# Altium schematic sheet LPGDetA1_cpu.SchDoc
size A4; DocumentNumber: 3; SheetNumber: 3; SheetTotal: 6; Subtitle0: Mikrokontoler; LotOfPieces: 1; SVNPath: SVNPath
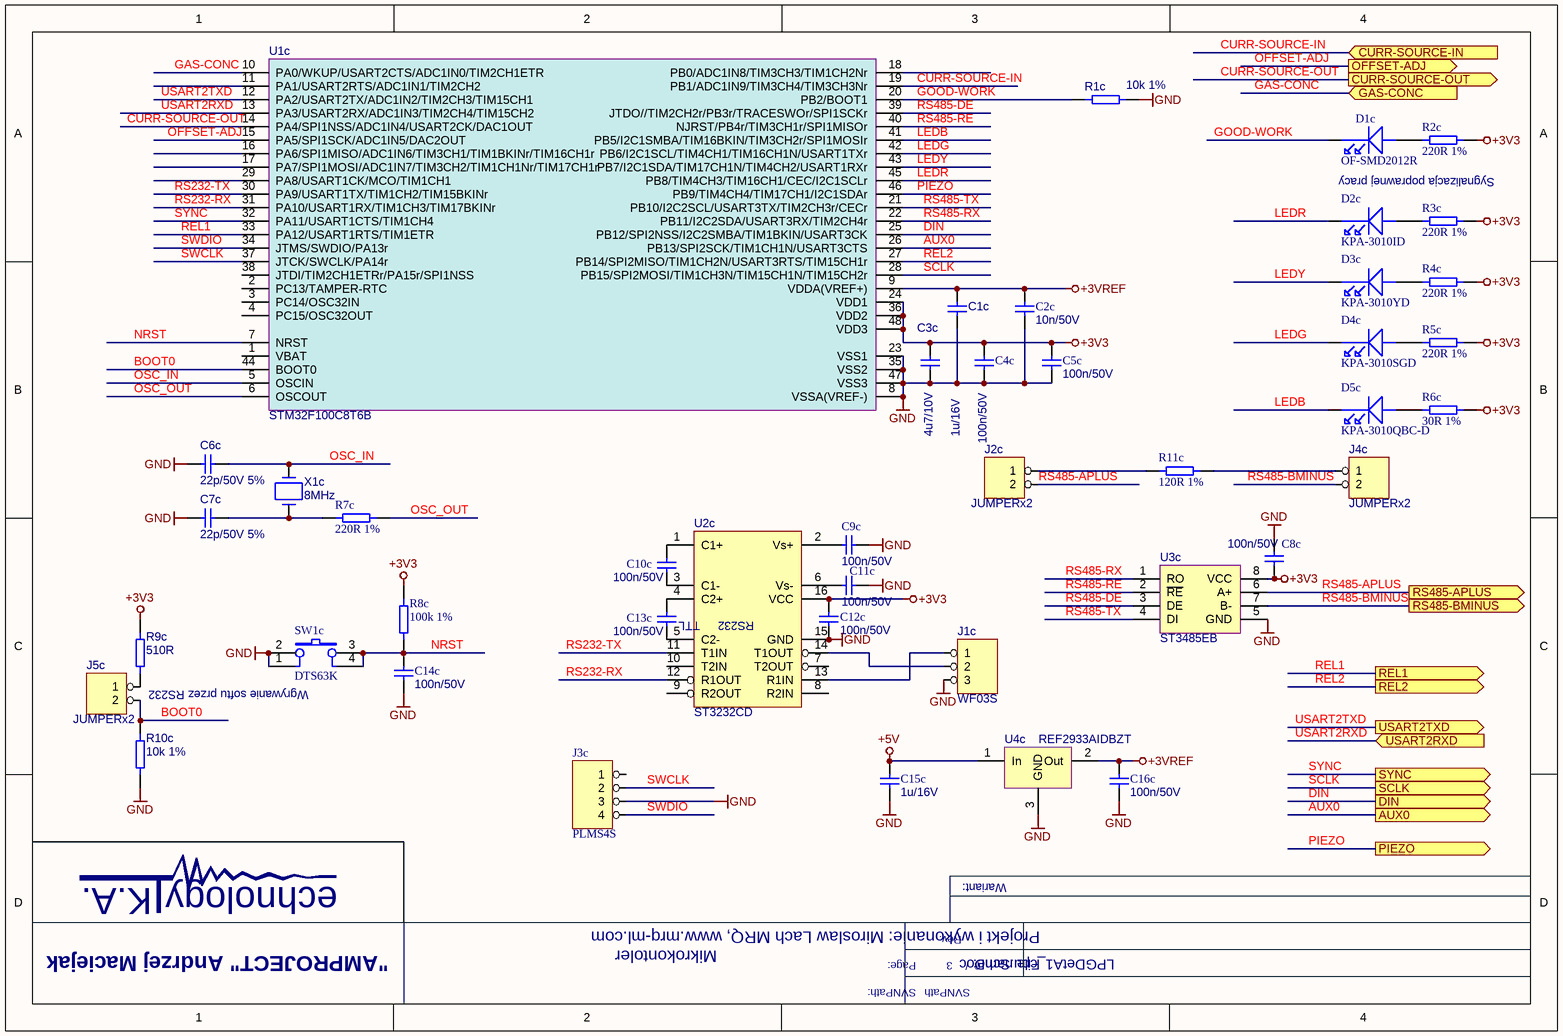
[diagram p0: LPGDetA1_cpu.SchDoc]

## Parts
?  (no value)
C1c  OtherParams: 1u/16V  [1206_0805]  (hidden comment: C0805C105K4RAC)
C2c  OtherParams: 10n/50V  [1206_0805]  (hidden comment: CL21B103KBANNNC)
C3c  OtherParams: 4u7/10V  [1206-IPC]  (hidden comment: CL31B475KPHNNNE)
C4c  OtherParams: 100n/50V  [1206_0805]  (hidden comment: CL21B104KBCNNNC)
C5c  OtherParams: 100n/50V  [1206_0805]  (hidden comment: CL21B104KBCNNNC)
C6c  OtherParams: 22p/50V 5%  [0805]  (hidden comment: CL21C220JBANNNC)
C7c  OtherParams: 22p/50V 5%  [0805]  (hidden comment: CL21C220JBANNNC)
C8c  OtherParams: 100n/50V  [1206_0805]  (hidden comment: CL21B104KBCNNNC)
C9c  OtherParams: 100n/50V  [1206_0805]  (hidden comment: CL21B104KBCNNNC)
C10c  OtherParams: 100n/50V  [1206_0805]  (hidden comment: CL21B104KBCNNNC)
C11c  OtherParams: 100n/50V  [1206_0805]  (hidden comment: CL21B104KBCNNNC)
C12c  OtherParams: 100n/50V  [1206_0805]  (hidden comment: CL21B104KBCNNNC)
C13c  OtherParams: 100n/50V  [1206_0805]  (hidden comment: CL21B104KBCNNNC)
C14c  OtherParams: 100n/50V  [1206_0805]  (hidden comment: CL21B104KBCNNNC)
C15c  OtherParams: 1u/16V  [1206_0805]  (hidden comment: C0805C105K4RAC)
C16c  OtherParams: 100n/50V  [1206_0805]  (hidden comment: CL21B104KBCNNNC)
D1c  OF-SMD2012R  [D0805]
D2c  KPA-3010ID  [KPA-3010SURCK]
D3c  KPA-3010YD  [KPA-3010SYCK]
D4c  KPA-3010SGD  [KPA-3010CGCK]
D5c  KPA-3010QBC-D  [KPA-3010QBC-D]
J1c  WF03S  [WF03S]
J2c  JUMPERx2  [2SIP100]
J3c  PLMS4S  [PLMS4S]
J4c  JUMPERx2  [2SIP100]
J5c  JUMPERx2  [2SIP100]
R1c  OtherParams: 10k 1%  [0805]  (hidden comment: 0805WAF10KT5E)
R2c  OtherParams: 220R 1%  [0805]  (hidden comment: 0805WAF 220R T5E)
R3c  OtherParams: 220R 1%  [0805]  (hidden comment: 0805WAF 220R T5E)
R4c  OtherParams: 220R 1%  [0805]  (hidden comment: 0805WAF 220R T5E)
R5c  OtherParams: 220R 1%  [0805]  (hidden comment: 0805WAF 220R T5E)
R6c  OtherParams: 30R 1%  [0805]  (hidden comment: 0805WAF 30R T5E)
R7c  OtherParams: 220R 1%  [0805]  (hidden comment: 0805WAF 220R T5E)
R8c  OtherParams: 100k 1%  [0805]  (hidden comment: 0805WAF 100K T5E)
R9c  OtherParams: 510R  [0805]  (hidden comment: 0805WAJ 510R T5E)
R10c  OtherParams: 10k 1%  [0805]  (hidden comment: 0805WAF10KT5E)
R11c  OtherParams: 120R 1%  [1206_0805]  (hidden comment: 0805WAF 120R T5E)
SW1c  DTS63K  [DTS63K]
U1c  STM32F100C8T6B  [MS-026ABC]
U2c  ST3232CD  [16SOIC150]
U3c  ST3485EB  [8SOIC150]
U4c  REF2933AIDBZT  [SOT23-3]
X1c  8MHz  [HXC-7SB]

## Ports
AUX0, CURR-SOURCE-IN, CURR-SOURCE-OUT, DIN, GAS-CONC, OFFSET-ADJ, PIEZO, REL1, REL2, RS485-APLUS, RS485-BMINUS, SCLK, SYNC, USART2RXD, USART2TXD

## Nets
+3V3: C3c.1 C4c.1 C5c.1 C8c.2 C12c.1 R2c.2 R3c.2 R4c.2 R5c.2 R6c.2 R8c.1 R9c.1 U1c.24(VDD1) U1c.36(VDD2) U1c.48(VDD3) U2c.16(VCC) U3c.8(VCC)
+3VREF: C1c.1 C2c.1 C16c.1 U1c.9(VDDA(VREF+)) U4c.2(Out)
+5V: C15c.1 U4c.1(In)
GND: C1c.2 C2c.2 C3c.2 C4c.2 C5c.2 C6c.1 C7c.1 C8c.1 C9c.2 C11c.2 C12c.2 C14c.2 C15c.2 C16c.2 J1c.3 J3c.3 R1c.2 R10c.1 SW1c.1 SW1c.2 U1c.8(VSSA(VREF-)) U1c.23(VSS1) U1c.35(VSS2) U1c.47(VSS3) U2c.15(GND) U3c.5(GND) U4c.3(GND)
AUX0: U1c.26(PB13/SPI2SCK/TIM1CH1N/USART3CTS) ; port AUX0
BOOT0: J5c.2 R10c.2 U1c.44(BOOT0)
CURR-SOURCE-IN: U1c.19(PB1/ADC1IN9/TIM3CH4/TIM3CH3Nr) ; port CURR-SOURCE-IN
CURR-SOURCE-OUT: U1c.14(PA4/SPI1NSS/ADC1IN4/USART2CK/DAC1OUT) ; port CURR-SOURCE-OUT
DIN: U1c.25(PB12/SPI2NSS/I2C2SMBA/TIM1BKIN/USART3CK) ; port DIN
GAS-CONC: U1c.10(PA0/WKUP/USART2CTS/ADC1IN0/TIM2CH1ETR) ; port GAS-CONC
GOOD-WORK: D1c.CATH R1c.1 U1c.20(PB2/BOOT1)
LEDB: D5c.CATH U1c.41(PB5/I2C1SMBA/TIM16BKIN/TIM3CH2r/SPI1MOSIr)
LEDG: D4c.CATH U1c.42(PB6/I2C1SCL/TIM4CH1/TIM16CH1N/USART1TXr)
LEDR: D2c.CATH U1c.45(PB8/TIM4CH3/TIM16CH1/CEC/I2C1SCLr)
LEDY: D3c.CATH U1c.43(PB7/I2C1SDA/TIM17CH1N/TIM4CH2/USART1RXr)
NRST: C14c.1 R8c.2 SW1c.3 SW1c.4 U1c.7(NRST)
OFFSET-ADJ: U1c.15(PA5/SPI1SCK/ADC1IN5/DAC2OUT) ; port OFFSET-ADJ
OSC_IN: C6c.2 U1c.5(OSCIN) X1c.1
OSC_OUT: R7c.2 U1c.6(OSCOUT)
PIEZO: U1c.46(PB9/TIM4CH4/TIM17CH1/I2C1SDAr) ; port PIEZO
REL1: U1c.33(PA12/USART1RTS/TIM1ETR) ; port REL1
REL2: U1c.27(PB14/SPI2MISO/TIM1CH2N/USART3RTS/TIM15CH1r) ; port REL2
RS232-RX: U1c.31(PA10/USART1RX/TIM1CH3/TIM17BKINr) U2c.12(R1OUT)
RS232-TX: U1c.30(PA9/USART1TX/TIM1CH2/TIM15BKINr) U2c.11(T1IN)
RS485-APLUS: J2c.2 U3c.6(A+) ; port RS485-APLUS
RS485-BMINUS: J4c.2 U3c.7(B-) ; port RS485-BMINUS
RS485-DE: U1c.39(JTDO//TIM2CH2r/PB3r/TRACESWOr/SPI1SCKr) U3c.3(DE)
RS485-RE: U1c.40(NJRST/PB4r/TIM3CH1r/SPI1MISOr) U3c.2(~{RE})
RS485-RX: U1c.22(PB11/I2C2SDA/USART3RX/TIM2CH4r) U3c.1(RO)
RS485-TX: U1c.21(PB10/I2C2SCL/USART3TX/TIM2CH3r/CECr) U3c.4(DI)
SCLK: U1c.28(PB15/SPI2MOSI/TIM1CH3N/TIM15CH1N/TIM15CH2r) ; port SCLK
SWCLK: J3c.2 U1c.37(JTCK/SWCLK/PA14r)
SWDIO: J3c.4 U1c.34(JTMS/SWDIO/PA13r)
SYNC: U1c.32(PA11/USART1CTS/TIM1CH4) ; port SYNC
USART2RXD: U1c.13(PA3/USART2RX/ADC1IN3/TIM2CH4/TIM15CH2) ; port USART2RXD
USART2TXD: U1c.12(PA2/USART2TX/ADC1IN2/TIM2CH3/TIM15CH1) ; port USART2TXD
NetC7c_2: C7c.2 R7c.1 X1c.2
NetC9c_1: C9c.1 U2c.2(Vs+)
NetC10c_1: C10c.1 U2c.1(C1+)
NetC10c_2: C10c.2 U2c.3(C1-)
NetC11c_1: C11c.1 U2c.6(Vs-)
NetC13c_1: C13c.1 U2c.4(C2+)
NetC13c_2: C13c.2 U2c.5(C2-)
NetD1c_ANOD: D1c.ANOD R2c.1
NetD2c_ANOD: D2c.ANOD R3c.1
NetD3c_ANOD: D3c.ANOD R4c.1
NetD4c_ANOD: D4c.ANOD R5c.1
NetD5c_ANOD: D5c.ANOD R6c.1
NetJ1c_1: J1c.1 U2c.13(R1IN)
NetJ1c_2: J1c.2 U2c.14(T1OUT)
NetJ2c_1: J2c.1 R11c.1
NetJ4c_1: J4c.1 R11c.2
NetJ5c_1: J5c.1 R9c.2

Not connected (* = marked no-connect by the designer): J3c 1; U1c 1(VBAT) 2(PC13/TAMPER-RTC) 3(PC14/OSC32IN) 4(PC15/OSC32OUT) 11(PA1/USART2RTS/ADC1IN1/TIM2CH2) 16(PA6/SPI1MISO/ADC1IN6/TIM3CH1/TIM1BKINr/TIM16CH1r) 17(PA7/SPI1MOSI/ADC1IN7/TIM3CH2/TIM1CH1Nr/TIM17CH1r) 18(PB0/ADC1IN8/TIM3CH3/TIM1CH2Nr) 29(PA8/USART1CK/MCO/TIM1CH1) 38(JTDI/TIM2CH1ETRr/PA15r/SPI1NSS); U2c 7(T2OUT) 8(R2IN) 9(R2OUT) 10(T2IN)

## Notes on the sheet
- Sygnalizacja poprawnej pracy
- Wgrywanie softu przez RS232
- K.A.
- echnology
- Wariant:
- Projekt i wykonanie: Miroslaw Lach MRQ, www.mrq-ml.com
- "AMPROJECT" Andrzej Maciejak
- SVNPath:
- Page:
- Rev.
- /
- File name:
- (in symbol ST3232CD[[/\]]16SOIC150) TTL; RS232

## Library data of the parts
? = KATECHNOLOGYLOGO
C1c = C0805C105K4RAC[[/\]]0805[[/\]]16V[[/\]]10%[[/\]]1u/16V: Manufacturer1: KEMET; MaxVoltage: 16V; Tolerance: 10%; Tmin: -55; Tmax: +125; Descript: capacitor 1uF, 16V, 0805, 10%, X7R; Currency1: PLZ; Amount1: 10000+; Currency5: PLN; Amount5: 100+; Value: C0805C105K4RAC; Supplier1: tme.pl; Reference1: C0805C105K4RAC; Price1: 0,099; Typ1: C0805C105K4RAC; Dimensions: 0805; ComponentLink1Description: Datasheet; ComponentLink1URL: http://www.mrq-ml.com/Parts/Capacitors/ceramic_chip_kemet.pdf; DateOfPrice1: 2010-03-06; Supplier5: tme.pl; Reference5: C0805C105K4RAC; Manufacturer5: KEMET; Typ5: C0805C105K4RAC; Price5: 0,099; DateOfPrice5: 2013-01-03
C2c = CL21B103KBANNNC[[/\]]0805[[/\]]50V[[/\]]10%[[/\]]10n/50V: MaxVoltage: 50V; Tolerance: 10%; Descript: capacitor 10nF/50V, 0805, X7R, 10%; Currency5: PLN; Amount5: 100+; Value: CL21B103KBANNNC; Dimensions: 0805; ComponentLink1Description: Datasheet; ComponentLink1URL: http://www.mrq-ml.com/Parts/Capacitors/mlcc_samsung.pdf; Supplier5: tme.pl; Reference5: CL21B103KBANNNC; Manufacturer5: Samsung; Typ5: CL21B103KBANNNC; Price5: 0,029; DateOfPrice5: 2012-09-19; Price1: 0,013
C3c = CL31B475KPHNNNE[[/\]]1206[[/\]]10V[[/\]]10%[[/\]]4u7/10V: Manufacturer1: Samsung; MaxVoltage: 10V; Tolerance: 10%; Tmin: -55; Tmax: +125; Descript: capacitor 4.7uF, 10V, X7R, 10%, 1206; Currency1: PLN; Amount1: 12000+; Amount5: 100+; Value: CL31B475KPHNNNE; Supplier1: tme.pl; Reference1: CL31B475KPHNNNE; Typ1: CL31B475KPHNNNE; Dimensions: 1206; ComponentLink1Description: Datasheet; ComponentLink1URL: http://www.mrq-ml.com/Parts/Capacitors/mlcc_samsung.pdf; DateOfPrice1: 2010-09-07; Supplier5: tme.pl; Reference5: CL31B475KPHNNNE; Manufacturer5: Samsung; Typ5: CL31B475KPHNNNE; Price5: 0,179; Currency5: PLN; DateOfPrice5: 2012-11-24; Price1: 0,179
C4c C5c C8c C9c C10c C11c C12c C13c C14c C16c = CL21B104KBCNNNC[[/\]]0805[[/\]]50V[[/\]]10%[[/\]]100n/50V: MaxVoltage: 50V; Tolerance: 10%; Descript: capacitor 100nF/50V, 0805, X7R, 10%; Currency5: PLN; Amount5: 100+; Value: CL21B104KBCNNNC; Price1: 0,019; Dimensions: 0805; ComponentLink1Description: Datasheet; ComponentLink1URL: http://www.mrq-ml.com/Parts/Capacitors/mlcc_samsung.pdf; Supplier5: tme.pl; Reference5: CL21B104KBCNNNC; Manufacturer5: Samsung; Typ5: CL21B104KBCNNNC; Price5: 0,025; DateOfPrice5: 2013-01-03
C6c C7c = CL21C220JBANNNC[[/\]]0805[[/\]]50V[[/\]]5%[[/\]]22p/50V 5%: Manufacturer1: Samsung; Amount2: 4000+; MaxVoltage: 50V; Tolerance: 5%; Tmin: -55; Tmax: +125; Descript: capacitor 22pF, 50V, COG 5%; Currency1: PLZ; Amount1: 12000+; Currency5: PLN; Amount5: 100+; Value: CL21C220JBANNNC; Supplier1: tme.pl; Reference1: CL21C220JBANNNC; Price1: 0,018; Price2: 0,012; Reference2: CL21C220JBANNNC; Supplier2: tme.pl; Typ1: CL21C220JBANNNC; Manufacturer2: Samsung; Dimensions: 0805; ComponentLink1Description: Datasheet; ComponentLink1URL: http://www.mrq-ml.com/Parts/Capacitors/mlcc_samsung.pdf; DateOfPrice1: 2010-04-07; Typ2: CL21C220JBANNNC; Currency2: PLZ; DateOfPrice2: 2009-08-16; Supplier5: tme.pl; Reference5: CL21C220JBANNNC; Manufacturer5: Samsung; Typ5: CL21C220JBANNNC; Price5: 0,029; DateOfPrice5: 2012-09-19
C15c = C0805C105K4RAC[[/\]]0805[[/\]]16V[[/\]]10%[[/\]]1u/16V: MaxVoltage: 16V; Tolerance: 10%; Descript: capacitor 1uF, 16V, 0805, 10%, X7R; Currency5: PLN; Amount5: 100+; Value: C0805C105K4RAC; Dimensions: 0805; ComponentLink1Description: Datasheet; ComponentLink1URL: http://www.mrq-ml.com/Parts/Capacitors/ceramic_chip_kemet.pdf; Supplier5: tme.pl; Reference5: C0805C105K4RAC; Manufacturer5: KEMET; Typ5: C0805C105K4RAC; Price5: 0,099; DateOfPrice5: 2013-01-03; Price1: 0,099
D1c = OF-SMD2012R[[/\]]D0805: Descript: LED; SMD; 0805; czerwony; 90-120mcd; 120°; Currency5: PLZ; Amount5: 10+; Value: OF-SMD2012R; Dimensions: D0805; ComponentLink1Description: Datasheet; ComponentLink1URL: http://www.mrq-ml.com/Parts/Diodes/of-smd2012r.pdf; Supplier5: tme.pl; Reference5: OF-SMD2012R; Manufacturer5: Optoflash; Typ5: OF-SMD2012R; Price5: 0,21; DateOfPrice5: 2012-11-24; Price1: 0,14
D2c = KPA-3010ID[[/\]]KPA-3010ID: Descript: 3.0x1.0mm Right angle smd chip led lamp red; Currency5: PLN; Amount5: 10+; Value: KPA-3010ID; Dimensions: KPA-3010ID; ComponentLink1Description: Datasheet; ComponentLink1URL: http://www.mrq-ml.com/Parts/Diodes/kp-3010id.pdf; Supplier5: tme.pl; Reference5: KPA-3010ID; Manufacturer5: Kingbright Electronic; Typ5: KPA-3010ID; Price5: 0,339; DateOfPrice5: 2013-01-12; Price1: 0,287
D3c = KPA-3010YD[[/\]]KPA-3010YD: Descript: 3.0x1.0mm Right angle smd chip led lamp yellow; Currency5: PLN; Amount5: 10+; Value: KPA-3010YD; Dimensions: KPA-3010YD; ComponentLink1Description: Datasheet; ComponentLink1URL: http://www.mrq-ml.com/Parts/Diodes/kpa-3010.pdf; Supplier5: tme.pl; Reference5: KPA-3010YD; Manufacturer5: Kingbright Electronic; Typ5: KPA-3010YD; Price5: 0,383; DateOfPrice5: 2013-01-12; Price1: 0,326
D4c = KPA-3010SGD[[/\]]KPA-3010SGD: Descript: 3.0x1.0mm Right angle smd chip led lamp green; Currency5: PLN; Amount5: 10+; Value: KPA-3010SGD; Dimensions: KPA-3010SGD; ComponentLink1Description: Datasheet; ComponentLink1URL: http://www.mrq-ml.com/Parts/Diodes/kpa-3010.pdf; Supplier5: tme.pl; Reference5: KPA-3010SGD; Manufacturer5: Kingbright Electronic; Typ5: KPA-3010SGD; Price5: 0,354; DateOfPrice5: 2013-01-12; Price1: 0,275
D5c = KPA-3010QBC-D[[/\]]KPA-3010QBC-D: Descript: 3.0x1.0mm Right angle smd chip led lamp blue; Reference5: 2146443; Currency5: PLN; Amount5: 1+; Value: KPA-3010QBC-D; Dimensions: KPA-3010QBC-D; ComponentLink1Description: Datasheet; ComponentLink1URL: http://www.mrq-ml.com/Parts/Diodes/KPA-3010QBC-D.pdf; Supplier5: farnell.com; Manufacturer5: Kingbright Electronic; Typ5: KPA-3010QBC-D; Price5: 0,87; DateOfPrice5: 2012-12-10; Price1: 0,7
J1c = WF03S[[/\]]WF03S: Descript: connector 2,54mm pitch, THT, 3 pole, stright; Reference1: WF03S-LF; Currency1: PLN; Amount1: 5000+; Reference5: WF03S-JS; Amount5: 10+; Value: WF03S; Dimensions: WF03S; ComponentLink1Description: Datasheet; ComponentLink1URL: http://www.mrq-ml.com/Parts/Connectors/WFXXS.pdf; Supplier1: maritex.com.pl; DateOfPrice1: 2010-03-06; Supplier5: maritex.com.pl; Price5: 0,055; Currency5: PLN; DateOfPrice5: 2012-11-24; Price1: 0,0550
J2c J4c J5c = JUMPERx2[[/\]]2.54mm: Descript: pin header 2 pin, 1/40 of PLD80S; Reference1: PLD80S-2; Currency1: PLN; Amount1: 80000+; Currency2: PLZ; Amount2: 40000+; Amount3: 9600+; Amount4: 1600+; Amount5: 20+; Value: JUMPERx2; Dimensions: 2.54mm; Supplier1: maritex.com.pl; DateOfPrice1: 2010-03-13; Supplier2: maritex.com.pl; Reference2: PLD80S-2; Price2: 0,01425; DateOfPrice2: 2009-11-24; Supplier3: maritex.com.pl; Reference3: PLD80S-2; Price3: 0,015; Currency3: PLZ; DateOfPrice3: 2009-11-24; Supplier4: maritex.com.pl; Reference4: PLD80S-2; Price4: 0,01575; Currency4: PLZ; DateOfPrice4: 2009-11-24; Supplier5: maritex.com.pl; Reference5: PLD80S-2; Price5: 0,0645; Currency5: PLN; DateOfPrice5: 2012-11-24; Price1: 0,0645
J3c = PLMS4S[[/\]]4x2mm: Descript: connector 2.00mm pitch, 4 poles, one row; Reference1: PLMS40S-LF*4/40; Currency1: PLN; Amount1: 500+; Reference5: PLMS40S-LF; Amount5: 1+; Value: PLMS4S; Dimensions: 4x2mm; ComponentLink1Description: Datasheet; ComponentLink1URL: http://www.mrq-ml.com/Parts/Connectors/plms40s-lf.pdf; Supplier1: maritex.com.pl; DateOfPrice1: 2010-11-19; Supplier5: maritex.com.pl; Price5: 0,085; Currency5: PLN; DateOfPrice5: 2012-11-24; Price1: 0,0850
R1c R10c = 0805WAF10KT5E[[/\]]0805[[/\]]0.125W[[/\]]1%[[/\]]10k 1%: Manufacturer1: Royal Ohm; Reference1: SMD0805 10K 1%; Amount1: 50000+; Amount2: 15000+; DissPower: 0.125W; Tolerance: 1%; Tmin: -55; Tmax: +155; Descript: Resistor 10kohm, 0805, 1%; Currency1: PLN; Currency2: PLZ; Amount4: 1000+; Reference5: SMD0805-10K-1%; Amount5: 100+; Value: 0805WAF10KT5E; Price2: 0,007; Reference2: SMD0805 10K 1%; Supplier1: tme.pl; Supplier2: tme.pl; Typ1: 0805WAF 10K T5E; Manufacturer2: Royal Ohm; Typ2: 0805WAF 10K T5E; Dimensions: 0805; ComponentLink1Description: Datasheet; ComponentLink1URL: http://www.mrq-ml.com/Parts/Resistors/RoyalOhm_rezystor-smd.pdf; DateOfPrice1: 2010-02-01; DateOfPrice2: 2009-10-20; Supplier4: tme.pl; Reference4: SMD0805 10K 1%; Manufacturer4: Royal Ohm; Typ4: 0805WAF 10K T5E; Price4: 0,019; Currency4: PLZ; DateOfPrice4: 2009-10-20; Supplier5: tme.pl; Manufacturer5: Royal Ohm; Typ5: 0805WAF 10K T5E; Price5: 0,029; Currency5: PLN; DateOfPrice5: 2013-01-03; Price1: 0,018
R2c R3c R4c R5c R7c = 0805WAF 220R T5E[[/\]]0805[[/\]]0.125W[[/\]]1%[[/\]]220R 1%: Manufacturer1: Royal Ohm; Reference1: SMD0805-220R-1%; Amount1: 50000+; DissPower: 0.125W; Tolerance: 1%; Descript: Resistor 220ohm, 0805, 1%; Currency1: PLN; Amount5: 100+; Value: 0805WAF 220R T5E; Supplier1: tme.pl; Typ1: 0805WAF 220R T5E; Dimensions: 0805; ComponentLink1Description: Datasheet; ComponentLink1URL: http://www.mrq-ml.com/Parts/Resistors/RoyalOhm_rezystor-smd.pdf; DateOfPrice1: 2012-01-30; Supplier5: tme.pl; Reference5: SMD0805-220R-1%; Manufacturer5: Royal Ohm; Typ5: 0805WAF 220R T5E; Price5: 0,029; Currency5: PLN; DateOfPrice5: 2012-09-19; Price1: 0,018
R6c = 0805WAF 30R T5E[[/\]]0805[[/\]]0.125W[[/\]]1%[[/\]]30R 1%: DissPower: 0.125W; Tolerance: 1%; Descript: Resistor 30ohm, 0805, 1%; Reference5: SMD0805-30R-1%; Currency5: PLN; Amount5: 100+; Value: 0805WAF 30R T5E; Dimensions: 0805; ComponentLink1Description: Datasheet; ComponentLink1URL: http://www.mrq-ml.com/Parts/Resistors/RoyalOhm_rezystor-smd.pdf; Supplier5: tme.pl; Manufacturer5: Royal Ohm; Typ5: 0805WAF 30R T5E; Price5: 0,029; DateOfPrice5: 2012-11-24; Price1: 0,029
R8c = 0805WAF 100K T5E[[/\]]0805[[/\]]0.125W[[/\]]1%[[/\]]100k 1%: Descript: Resistor 100kohm, 0805, 1%; DissPower: 0.125W; Tolerance: 1%; Reference5: SMD0805-100K-1%; Currency5: PLN; Amount5: 100+; Value: 0805WAF 100K T5E; Dimensions: 0805; ComponentLink1Description: Datasheet; ComponentLink1URL: http://www.mrq-ml.com/Parts/Resistors/RoyalOhm_rezystor-smd.pdf; Supplier5: tme.pl; Manufacturer5: Royal Ohm; Typ5: 0805WAF 100K T5E; Price5: 0,029; DateOfPrice5: 2012-09-20; Price1: 0,017
R9c = 0805WAJ 510R T5E[[/\]]0805[[/\]]0.125W[[/\]]5%[[/\]]510R: Manufacturer1: Royal Ohm; Reference1: SMD0805 510R; Amount1: 50000+; Amount2: 15000+; DissPower: 0.125W; Tolerance: 5%; Tmin: -55; Tmax: +155; Descript: Resistor 510 ohm, 0805, 5%; Currency1: PLN; Currency2: PLZ; Amount4: 1000+; Reference5: SMD0805-510R; Amount5: 100+; Value: 0805WAJ 510R T5E; Supplier1: tme.pl; Price2: 0,004; Reference2: SMD0805 510R; Supplier2: tme.pl; Typ1: 0805WAJ 510R T5E; Manufacturer2: Royal Ohm; Typ2: 0805WAJ 510R T5E; Dimensions: 0805; ComponentLink1Description: Datasheet; ComponentLink1URL: http://www.mrq-ml.com/Parts/Resistors/RoyalOhm_rezystor-smd.pdf; DateOfPrice1: 2010-02-03; DateOfPrice2: 2009-10-06; Supplier4: tme.pl; Reference4: SMD0805 510R; Manufacturer4: Royal Ohm; Typ4: 0805WAJ 510R T5E; Price4: 0,013; Currency4: PLZ; DateOfPrice4: 2009-10-06; Supplier5: tme.pl; Manufacturer5: Royal Ohm; Typ5: 0805WAJ 510R T5E; Price5: 0,025; Currency5: PLN; DateOfPrice5: 2012-11-24; Price1: 0,025
R11c = 0805WAF 120R T5E[[/\]]0805[[/\]]0.125W[[/\]]1%[[/\]]120R 1%: DissPower: 0.125W; Tolerance: 1%; Descript: Resistor 120ohm, 0805, 1%; Reference5: SMD0805-120R-1%; Currency5: PLN; Amount5: 100+; Value: 0805WAF 120R T5E; Dimensions: 0805; ComponentLink1Description: Datasheet; ComponentLink1URL: http://www.mrq-ml.com/Parts/Resistors/RoyalOhm_rezystor-smd.pdf; Supplier5: tme.pl; Manufacturer5: Royal Ohm; Typ5: 0805WAF 120R T5E; Price5: 0,029; DateOfPrice5: 2012-11-24; Price1: 0,029
SW1c = DTS63K[[/\]]DTS63K[[/\]]6x6: Descript: tactile switch; Currency5: PLN; Amount5: 5+; Typ5: DTS-63K; Value: DTS63K; Dimensions: 6x6; ComponentLink1Description: Datasheet; ComponentLink1URL: http://www.mrq-ml.com/Parts/Electromechanical/DTSxA62x6xx644.pdf; Supplier5: tme.pl; Reference5: DTS63K; Manufacturer5: Diptronics; Price5: 0,5655; DateOfPrice5: 2012-09-21; OtherParams: DTS63K
U1c = STM32F100C8T6B[[/\]]MS-026ABC: Manufacturer1: ST; Reference1: 1838511; Amount1: 100+; Tmin: -40; Tmax: +85; Descript: MCU, 32BIT, CORTEXM3, 64K FLASH, 48LQFP; Currency1: PLN; Amount5: 1+; Value: STM32F100C8T6B; Supplier1: farnell.com; Dimensions: MS-026ABC; ComponentLink1Description: Datasheet; ComponentLink1URL: http://www.mrq-ml.com/Parts/ICs/STM32F103xC_D_E.pdf; Typ1: STM32F100C8T6B; DateOfPrice1: 2012-01-26; Supplier5: kamami.pl; Reference5: STM32F100C8T6B; Manufacturer5: ST; Typ5: STM32F100C8T6B; Price5: 10,87; Currency5: PLN; DateOfPrice5: 2012-11-24; Price1: 9,51
U2c = ST3232CD[[/\]]16SOIC150: DUAL EIA-232 DRIVER/RECEIVER; Manufacturer1: ST; Amount1: 100+; Amount2: 25+; Amount4: 3+; Tmin: 0; Tmax: 70; Descript: DUAL EIA-232 DRIVER/RECEIVER, 3-5V; Currency1: PLN; Currency2: PLZ; Amount5: 1+; Value: ST3232CD; Price2: 2,41; Reference1: ST3232CD; Reference2: ST3232CD; Supplier1: tme.pl; Supplier2: tme.pl; Manufacturer2: ST; Supplier4: tme.pl; Reference4: ST3232CD; Manufacturer4: ST; Price4: 3,09; Dimensions: 16SOIC150; ComponentLink1Description: Datasheet; ComponentLink1URL: http://www.mrq-ml.com/Parts/ICs/ST3232.pdf; Typ1: ST3232CD; DateOfPrice1: 2010-03-06; Typ2: ST3232CD; DateOfPrice2: 2009-11-15; Typ4: ST3232CD; Currency4: PLZ; DateOfPrice4: 2009-11-15; Supplier5: tme.pl; Reference5: ST3232CD; Manufacturer5: ST; Typ5: ST3232CD; Price5: 2,65; Currency5: PLN; DateOfPrice5: 2012-11-24; Price1: 2,03
U3c = ST3485EB[[/\]]8SOIC150: Descript: 3.3V powered, 15kV ESD protected, up to 12Mbps RS485/RS422 transceiver; Reference5: ST3485EBD; Currency5: PLN; Amount5: 1+; Value: ST3485EB; Dimensions: 8SOIC150; ComponentLink1Description: Datasheet; ComponentLink1URL: http://www.mrq-ml.com/Parts/ICs/ST3485.pdf; Supplier5: tme.pl; Manufacturer5: ST; Typ5: ST3485EBD; Price5: 4,41; DateOfPrice5: 2012-11-24; Price1: 3,05
U4c = REF2933AIDBZT[[/\]]SOT23-3: Descript: 100ppm/°C, 50µA in SOT23-3 CMOS VOLTAGE REFERENCE; Reference5: 1459250; Currency5: PLN; Amount5: 1+; Value: REF2933AIDBZT; Price1: 6,11; Dimensions: SOT23-3; ComponentLink1Description: Datasheet; ComponentLink1URL: http://www.mrq-ml.com/Parts/ICs/REF29xx.pdf; Supplier5: farnell.com; Manufacturer5: Texas Instruments; Typ5: REF2933AIDBZT; Price5: 8,82; DateOfPrice5: 2012-11-15
X1c = 12SMX (B) 30/5020/16 8.0 MHZ[[/\]]HC49SMP[[/\]]8MHz: Manufacturer1: IQD Frequency Products; Reference1: 1276690; Descript: oscillator 8MHz, 5x7mm; Currency1: PLN; Amount1: 100+; Amount5: 1+; Value: 12SMX (B) 30/5020/16 8.0 MHZ; OtherParams: 8MHz; Supplier1: farnell.com; Dimensions: HC49SMP; Price1: 3,6100; DateOfPrice1: 2011-12-01; Supplier5: farnell.com; Reference5: 1276690; Price5: 4,78; Currency5: PLN; DateOfPrice5: 2012-11-03; ComponentLink1URL: oscillator 8MHz, 5x7mm; Typ1: 12SMX (B) 30/5020/16 8.0 MHZ; Manufacturer5: IQD Frequency Products; Typ5: 12SMX (B) 30/5020/16 8.0 MHZ; Price11: 3,5100